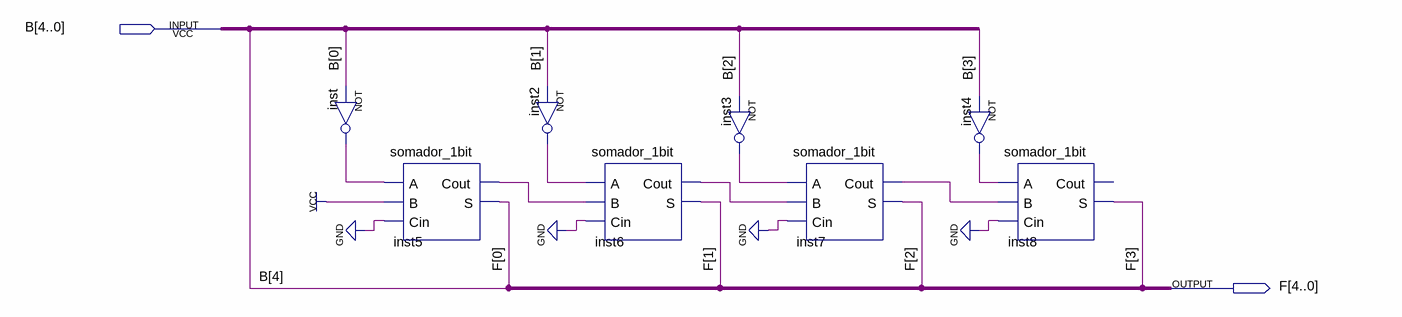
[diagram p0: schematic sheet]
// Quartus schematic Complemento_2.bdf as structural Verilog: 8 symbols, 2 pins
module Complemento_2 (
  input  [4:0] B,
  output [4:0] F
);

  wire inst2_out, inst3_out, inst4_out, inst5_cout, inst6_cout, inst7_cout, inst_out;

  not inst (inst_out, B[0]);
  somador_1bit inst5 (.A(inst_out), .B(1'b1), .Cin(1'b0), .Cout(inst5_cout), .S(F[0]));
  not inst2 (inst2_out, B[1]);
  somador_1bit inst6 (.A(inst2_out), .B(inst5_cout), .Cin(1'b0), .Cout(inst6_cout), .S(F[1]));
  not inst3 (inst3_out, B[2]);
  somador_1bit inst7 (.A(inst3_out), .B(inst6_cout), .Cin(1'b0), .Cout(inst7_cout), .S(F[2]));
  not inst4 (inst4_out, B[3]);
  somador_1bit inst8 (.A(inst4_out), .B(inst7_cout), .Cin(1'b0), .S(F[3]));  // open: Cout
endmodule
